# EAGLE schematic measurementBoard (EAGLE 7.3.0)
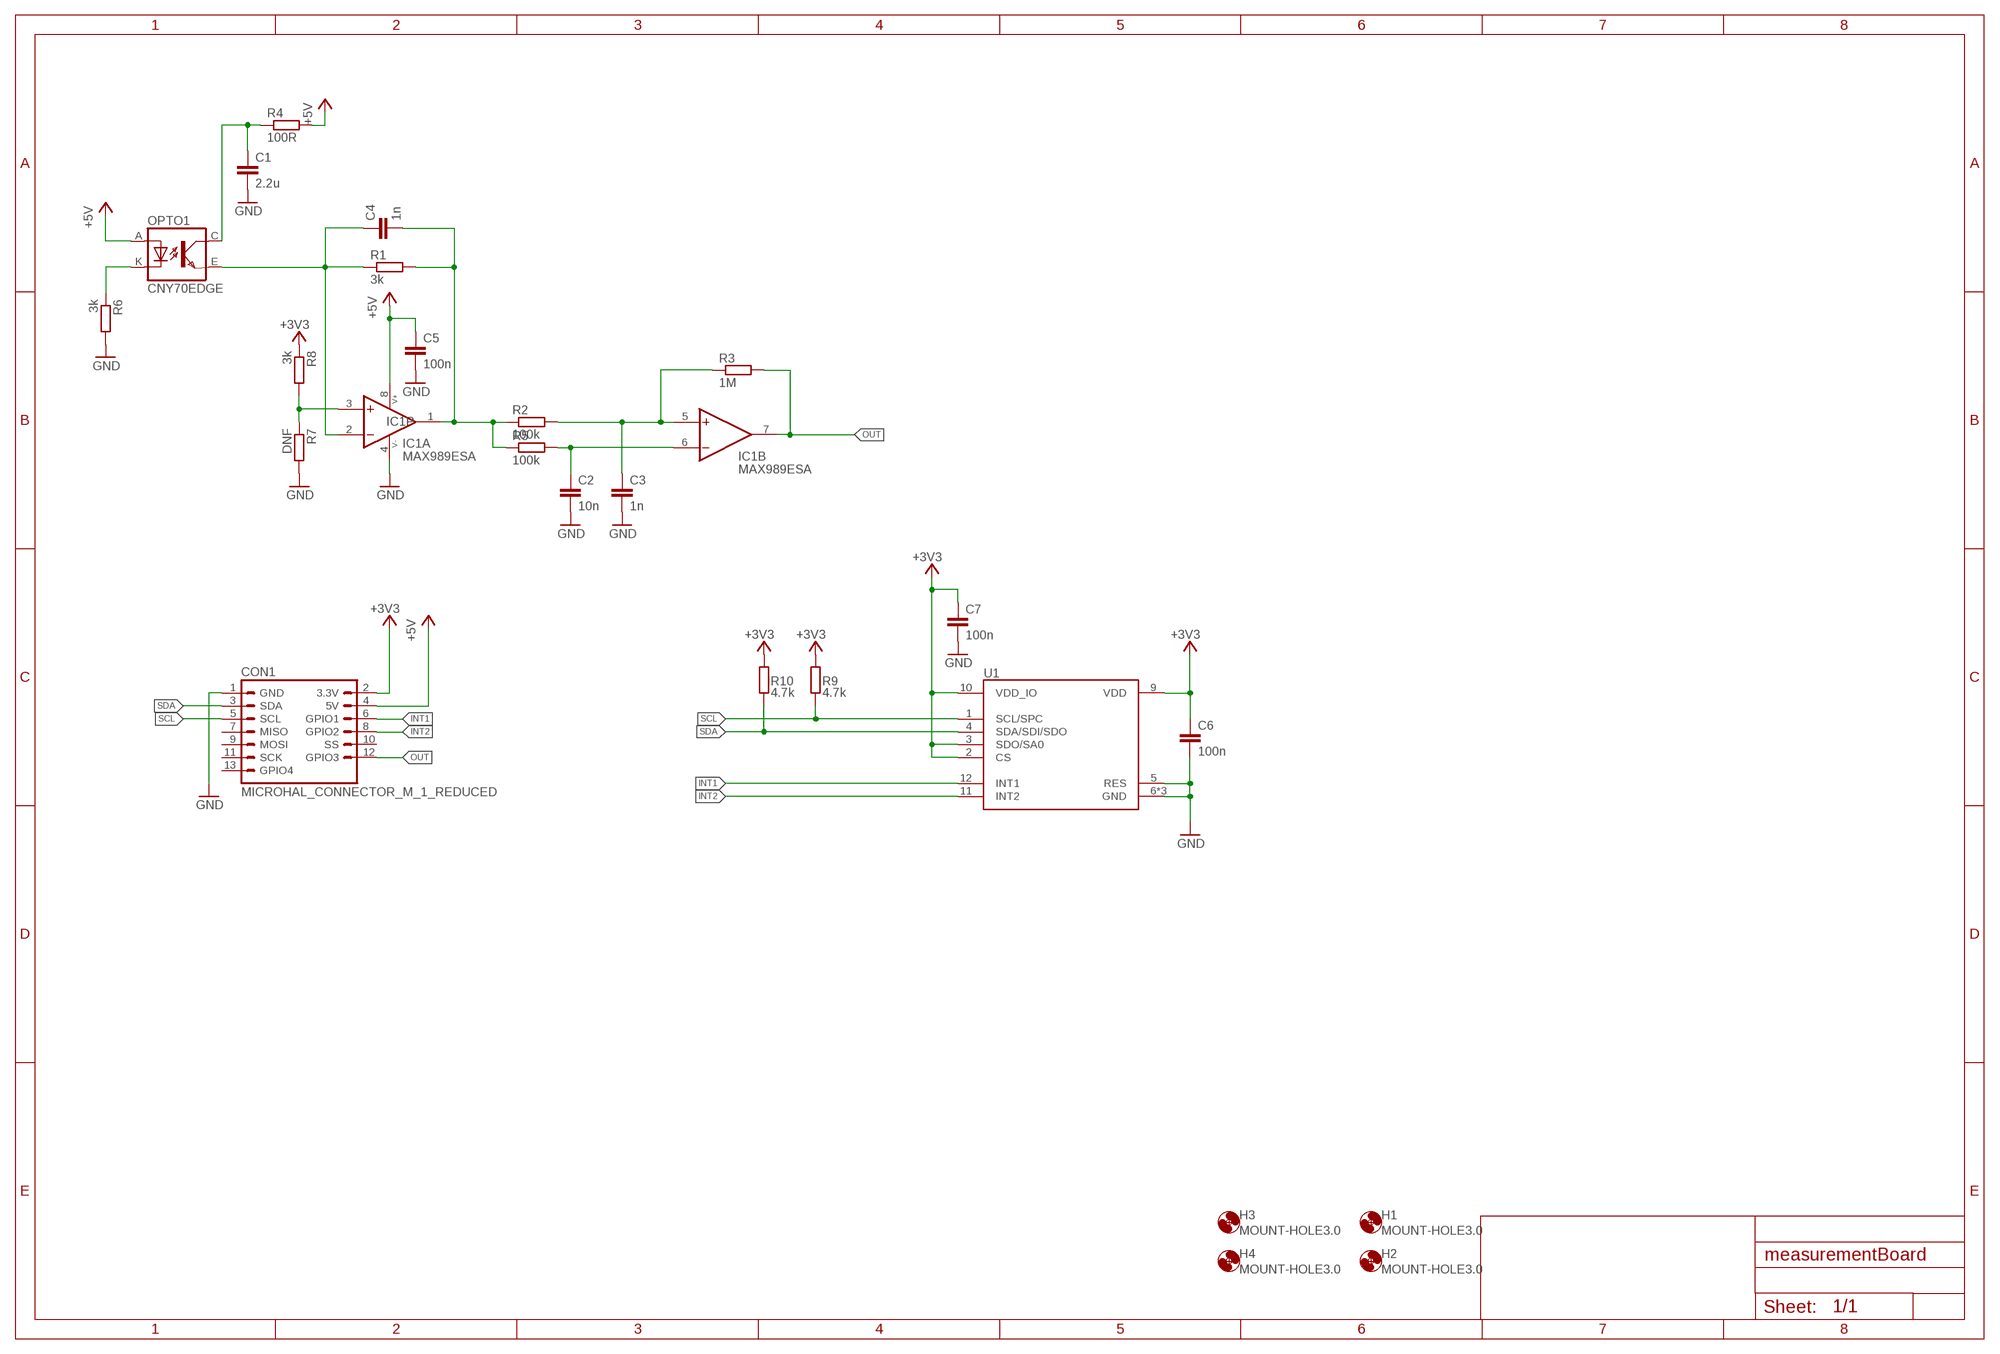
[diagram p0: schematic, sheet 1]

## Parts
C1  2.2u  C-EUC0603K  [C0603K]
C2  10n  C-EUC0603K  [C0603K]
C3  1n  C-EUC0603K  [C0603K]
C4  1n  C-EUC0603K  [C0603K]
C5  100n  C-EUC0603K  [C0603K]
C6  100n  C-EUC0603K  [C0603K]
C7  100n  C-EUC0603K  [C0603K]
CON1  MICROHAL_CONNECTOR_M_1_REDUCED  [MICROHAL_CONNECTOR_M_1_REDUCED_EDGE]
H1  MOUNT-HOLE3.0  [3,0]
H2  MOUNT-HOLE3.0  [3,0]
H3  MOUNT-HOLE3.0  [3,0]
H4  MOUNT-HOLE3.0  [3,0]
IC1  MAX989ESA  [SO08]
OPTO1  CNY70EDGE  [CNY70_EDGE]
R1  3k  R-EU_R0603  [R0603]
R2  100k  R-EU_R0603  [R0603]
R3  1M  R-EU_R0603  [R0603]
R4  100R  R-EU_R0603  [R0603]
R5  100k  R-EU_R0603  [R0603]
R6  3k  R-EU_R0603  [R0603]
R7  DNF  R-EU_R0603  [R0603]
R8  3k  R-EU_R0603  [R0603]
R9  4.7k  R-EU_R0603  [R0603]
R10  4.7k  R-EU_R0603  [R0603]
U1  LIS2DH12  [LGA-12]

## Nets
+3V3: C6.1 C7.1 CON1.2(3.3V) R8.1 R9.1 R10.1 U1.2(CS) U1.3(SDO/SA0) U1.9(VDD) U1.10(VDD_IO)
+5V: C5.1 CON1.4(5V) IC1.8(P:V+) OPTO1.A R4.2
GND: C1.2 C2.2 C3.2 C5.2 C6.2 C7.2 CON1.1(GND) IC1.4(P:V-) R6.2 R7.2 U1.5(RES) U1.6(GND) U1.7(GND) U1.8(GND)
INT1: CON1.6(GPIO1) U1.12(INT1)
INT2: CON1.8(GPIO2) U1.11(INT2)
N$1: C4.2 IC1.1(A:OUT) R1.2 R2.1 R5.1
N$2: C4.1 IC1.2(A:-IN) OPTO1.E(EMI) R1.1
N$3: C3.1 IC1.5(B:+IN) R2.2 R3.1
N$5: C1.1 OPTO1.C(COL) R4.1
N$6: C2.1 IC1.6(B:-IN) R5.2
N$7: OPTO1.K(C) R6.1
N$8: IC1.3(A:+IN) R7.1 R8.2
OUT: CON1.12(GPIO3) IC1.7(B:OUT) R3.2
SCL: CON1.5(SCL) R9.2 U1.1(SCL/SPC)
SDA: CON1.3(SDA) R10.2 U1.4(SDA/SDI/SDO)
Unconnected: CON1.7(MISO) CON1.9(MOSI) CON1.10(SS) CON1.11(SCK) CON1.13(GPIO4)

## Library data of the parts
C1-C7 = rcl:C-EU: CAPACITOR, European symbol
CON1 = microhal-connector_v2:MICROHAL_CONNECTOR_M_1_REDUCED
H1-H4 = holes:MOUNT-HOLE: MOUNTING HOLE with drill center marker
IC1 = maxim:MAX9*: Micropower, Low-Voltage Rail-to-Rail I/O Comparators Source: http://pdfserv.maxim-ic.com/en/ds/MAX985-MAX994.pdf; MF: MAXIM; MPN: MAX989ESA+; OC_FARNELL: 1550496; OC_NEWARK: 23K6628
OPTO1 = cny70:CNY70
R1-R10 = rcl:R-EU_: RESISTOR, European symbol
U1 = lis2dh12:LIS2DH12